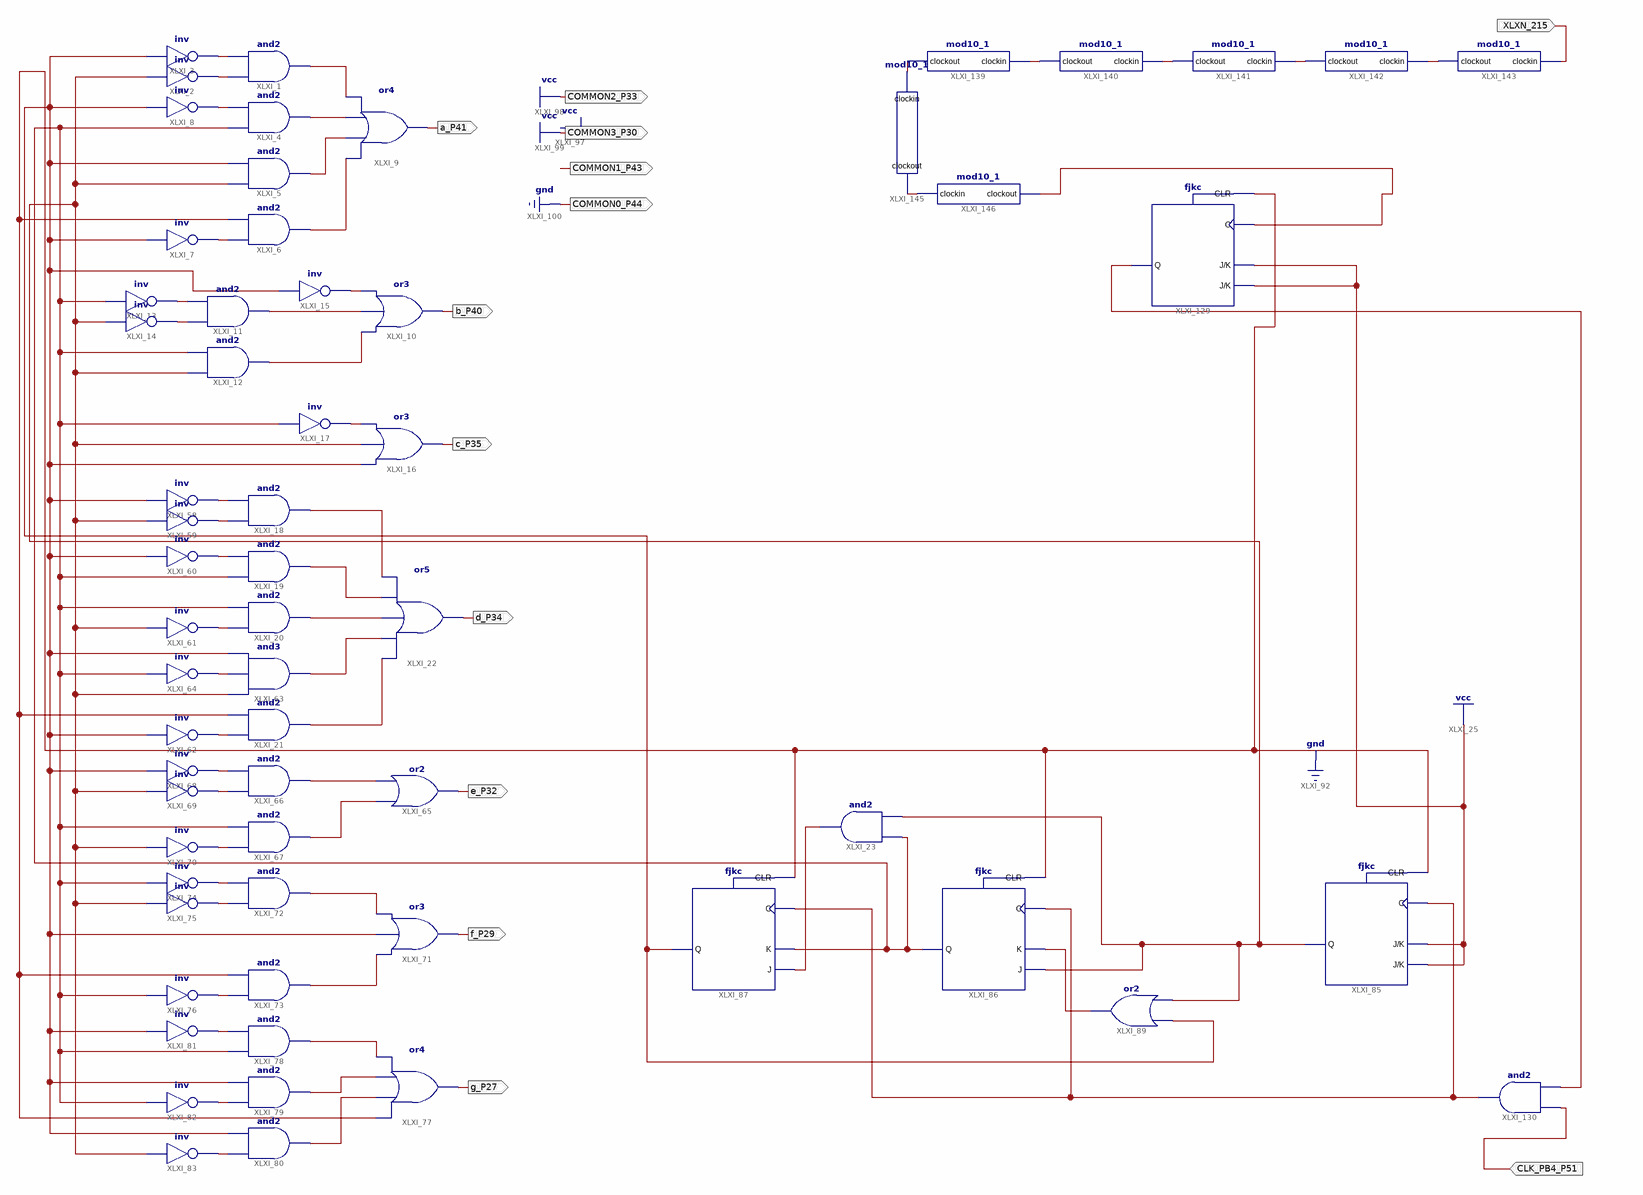
[diagram p0: schematic sheet 1]
// Xilinx ISE schematic JK.sch (spartan6) as structural Verilog: 62 symbols, 13 ports
module JK (
  input  CLK_PB4_P51,
  input  XLXN_215,
  output a_P41,
  output b_P40,
  output c_P35,
  output d_P34,
  output e_P32,
  output f_P29,
  output g_P27,
  output COMMON3_P30,
  output COMMON2_P33,
  output COMMON1_P43,
  output COMMON0_P44
);

  wire A_SW0_P66, B_SW1_P62, C_SW2_P61, clk_P45, XLXN_1, XLXN_2, XLXN_3, XLXN_4, XLXN_5, XLXN_6, XLXN_7,
       XLXN_8, XLXN_11, XLXN_12, XLXN_13, XLXN_14, XLXN_15, XLXN_17, XLXN_19, XLXN_20, XLXN_21, XLXN_22,
       XLXN_45, XLXN_67, XLXN_68, XLXN_69, XLXN_70, XLXN_71, XLXN_72, XLXN_73, XLXN_86, XLXN_87, XLXN_88,
       XLXN_89, XLXN_90, XLXN_96, XLXN_97, XLXN_98, XLXN_99, XLXN_100, XLXN_107, XLXN_108, XLXN_109,
       XLXN_111, XLXN_112, XLXN_113, XLXN_128, XLXN_204, XLXN_208, XLXN_209, XLXN_210, XLXN_211, XLXN_216,
       XLXN_217, XLXN_218;

  and XLXI_1 (XLXN_5, XLXN_1, XLXN_2);
  not XLXI_2 (XLXN_1, A_SW0_P66);
  not XLXI_3 (XLXN_2, C_SW2_P61);
  and XLXI_4 (XLXN_6, B_SW1_P62, XLXN_4);
  and XLXI_5 (XLXN_7, A_SW0_P66, C_SW2_P61);
  and XLXI_6 (XLXN_8, XLXN_3, 1'b0);
  not XLXI_7 (XLXN_3, C_SW2_P61);
  not XLXI_8 (XLXN_4, C_SW2_P61);
  or XLXI_9 (a_P41, XLXN_8, XLXN_7, XLXN_6, XLXN_5);
  or XLXI_10 (b_P40, XLXN_15, XLXN_14, XLXN_13);
  and XLXI_11 (XLXN_14, XLXN_12, XLXN_11);
  and XLXI_12 (XLXN_15, A_SW0_P66, B_SW1_P62);
  not XLXI_13 (XLXN_11, B_SW1_P62);
  not XLXI_14 (XLXN_12, A_SW0_P66);
  not XLXI_15 (XLXN_13, C_SW2_P61);
  or XLXI_16 (c_P35, C_SW2_P61, A_SW0_P66, XLXN_17);
  not XLXI_17 (XLXN_17, B_SW1_P62);
  and XLXI_18 (XLXN_21, XLXN_69, XLXN_68);
  and XLXI_19 (XLXN_20, B_SW1_P62, XLXN_70);
  and XLXI_20 (XLXN_19, XLXN_71, B_SW1_P62);
  and XLXI_21 (XLXN_67, XLXN_72, 1'b0);
  or XLXI_22 (d_P34, XLXN_67, XLXN_22, XLXN_19, XLXN_20, XLXN_21);
  not XLXI_58 (XLXN_68, C_SW2_P61);
  not XLXI_59 (XLXN_69, A_SW0_P66);
  not XLXI_60 (XLXN_70, C_SW2_P61);
  not XLXI_61 (XLXN_71, A_SW0_P66);
  not XLXI_62 (XLXN_72, C_SW2_P61);
  and XLXI_63 (XLXN_22, A_SW0_P66, XLXN_73, C_SW2_P61);
  not XLXI_64 (XLXN_73, B_SW1_P62);
  or XLXI_65 (e_P32, XLXN_90, XLXN_89);
  and XLXI_66 (XLXN_89, XLXN_87, XLXN_86);
  and XLXI_67 (XLXN_90, XLXN_88, B_SW1_P62);
  not XLXI_68 (XLXN_86, C_SW2_P61);
  not XLXI_69 (XLXN_87, A_SW0_P66);
  not XLXI_70 (XLXN_88, A_SW0_P66);
  and XLXI_73 (XLXN_100, XLXN_98, 1'b0);
  and XLXI_72 (XLXN_99, XLXN_97, XLXN_96);
  or XLXI_71 (f_P29, XLXN_100, C_SW2_P61, XLXN_99);
  not XLXI_74 (XLXN_96, B_SW1_P62);
  not XLXI_75 (XLXN_97, A_SW0_P66);
  not XLXI_76 (XLXN_98, B_SW1_P62);
  and XLXI_78 (XLXN_107, B_SW1_P62, XLXN_111);
  and XLXI_79 (XLXN_108, XLXN_112, C_SW2_P61);
  and XLXI_80 (XLXN_109, XLXN_113, C_SW2_P61);
  not XLXI_81 (XLXN_111, C_SW2_P61);
  not XLXI_82 (XLXN_112, B_SW1_P62);
  not XLXI_83 (XLXN_113, A_SW0_P66);
  or XLXI_77 (g_P27, 1'b0, XLXN_109, XLXN_108, XLXN_107);
  fjkc XLXI_85 (.C(clk_P45), .CLR(1'b0), .J(1'b1), .K(1'b1), .Q(A_SW0_P66));
  fjkc XLXI_86 (.C(clk_P45), .CLR(1'b0), .J(A_SW0_P66), .K(XLXN_128), .Q(B_SW1_P62));
  fjkc XLXI_87 (.C(clk_P45), .CLR(1'b0), .J(XLXN_45), .K(B_SW1_P62), .Q(C_SW2_P61));
  and XLXI_23 (XLXN_45, A_SW0_P66, B_SW1_P62);
  or XLXI_89 (XLXN_128, A_SW0_P66, C_SW2_P61);
  fjkc XLXI_129 (.C(XLXN_218), .CLR(1'b0), .J(1'b1), .K(1'b1), .Q(XLXN_204));
  and XLXI_130 (clk_P45, XLXN_204, CLK_PB4_P51);
  mod10_1 XLXI_139 (.clockin(XLXN_208), .clockout(XLXN_216));
  mod10_1 XLXI_140 (.clockin(XLXN_209), .clockout(XLXN_208));
  mod10_1 XLXI_141 (.clockin(XLXN_210), .clockout(XLXN_209));
  mod10_1 XLXI_142 (.clockin(XLXN_211), .clockout(XLXN_210));
  mod10_1 XLXI_143 (.clockin(XLXN_215), .clockout(XLXN_211));
  mod10_1 XLXI_145 (.clockin(XLXN_216), .clockout(XLXN_217));
  mod10_1 XLXI_146 (.clockin(XLXN_217), .clockout(XLXN_218));

  assign COMMON0_P44 = 1'b0;
  assign COMMON1_P43 = 1'b1;
  assign COMMON2_P33 = 1'b1;
  assign COMMON3_P30 = 1'b1;
endmodule
